# EAGLE design Mezzanine (EAGLE 9.6.1)
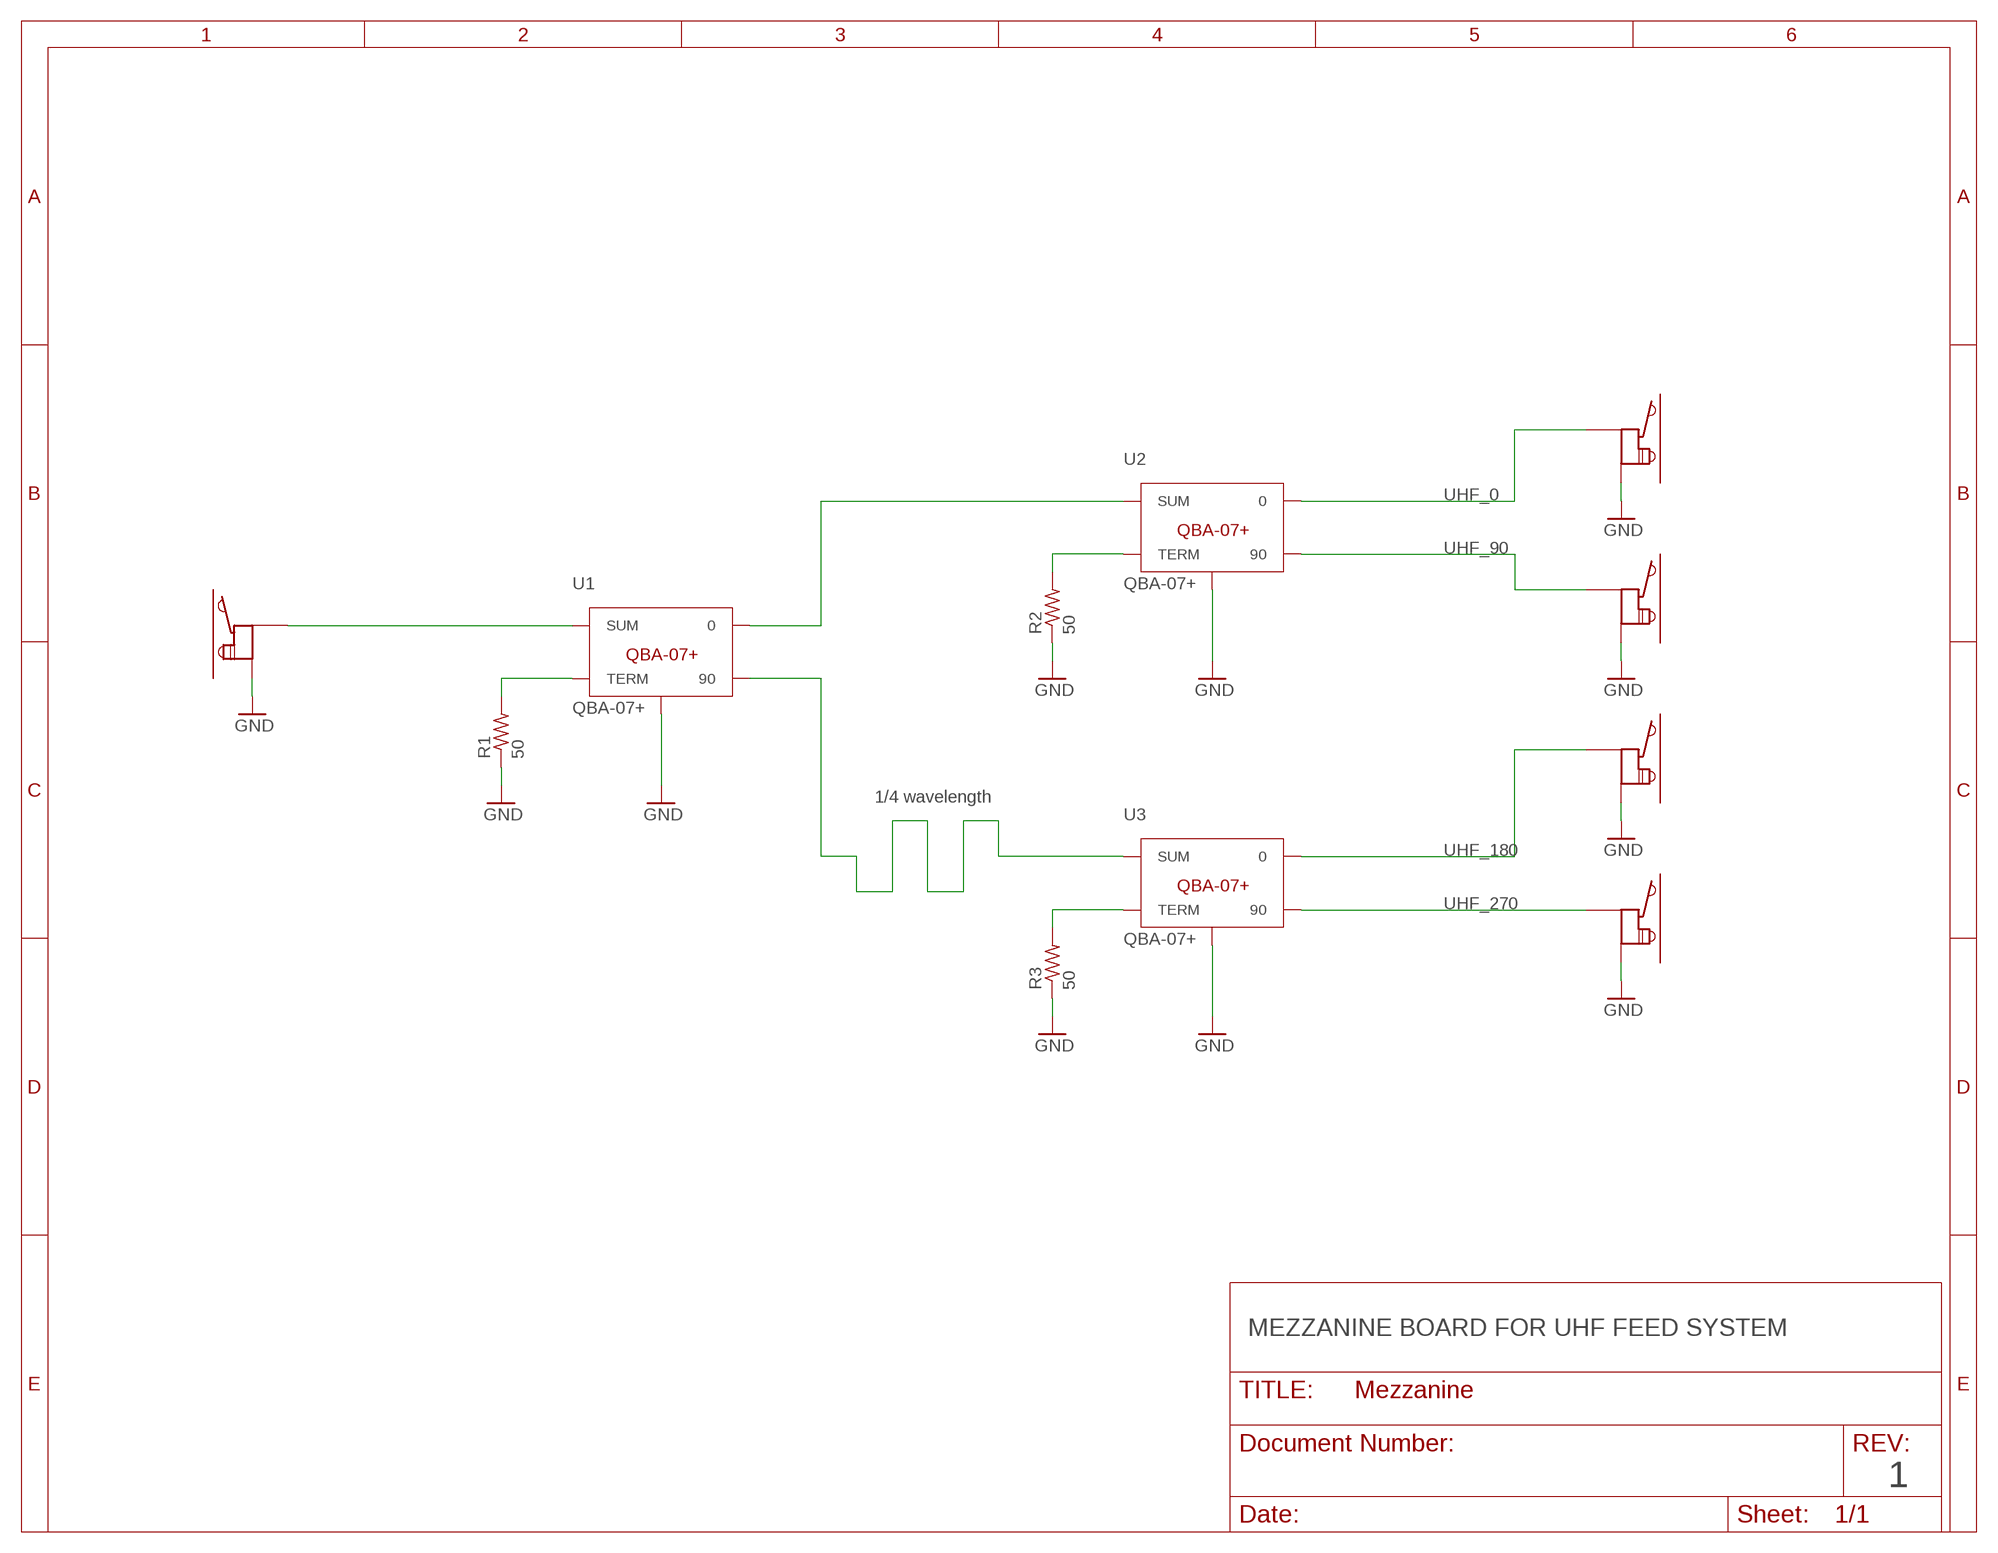
[diagram p0: schematic, sheet 1]

## Parts
R1  50  R-US_0805-B-NOSILK  [.0805-B-NOSILK]
R2  50  R-US_0805-B-NOSILK  [.0805-B-NOSILK]
R3  50  R-US_0805-B-NOSILK  [.0805-B-NOSILK]
U1  QBA-07+  [QBA-07+]
U2  QBA-07+  [QBA-07+]
U3  QBA-07+  [QBA-07+]
U$1  R107064070  [R107064070]
U$2  R107064070  [R107064070]
U$3  R107064070  [R107064070]
U$4  R107064070  [R107064070]
U$5  R107064070  [R107064070]

## Nets
GND: R1.1 R2.1 R3.1 U1.2(GND) U1.3(GND) U1.4(GND) U1.7(GND) U1.8(GND) U1.9(GND) U1.GND-NO-PAD(GND) U2.2(GND) U2.3(GND) U2.4(GND) U2.7(GND) U2.8(GND) U2.9(GND) U2.GND-NO-PAD(GND) U3.2(GND) U3.3(GND) U3.4(GND) U3.7(GND) U3.8(GND) U3.9(GND) U3.GND-NO-PAD(GND) U$1.P$2 U$1.P$3 U$2.P$2 U$2.P$3 U$3.P$2 U$3.P$3 U$4.P$2 U$4.P$3 U$5.P$2 U$5.P$3
N$1 [RF]: U1.1(SUM) U$1.P$1
N$2 [RF]: U1.6 U2.1(SUM)
N$3 [RF]: R1.2 U1.5(TERM)
N$4 [RF]: R2.2 U2.5(TERM)
N$5 [RF]: U1.10 U3.1(SUM)
N$6 [RF]: R3.2 U3.5(TERM)
UHF_0 [RF]: U2.6 U$2.P$1
UHF_90 [RF]: U2.10 U$3.P$1
UHF_180 [RF]: U3.6 U$4.P$1
UHF_270 [RF]: U3.10 U$5.P$1

## Notes on the sheet
- 1/4 wavelength
- MEZZANINE BOARD FOR UHF FEED SYSTEM
- 1

## Library data of the parts
R1-R3 = oresat-rcl:R-US_: RESISTOR, American symbol
U1-U3 = U-MiniCirc-QBA-07+_Phase-shifter:QBA-07+
U$1-U$5 = J-Radiall-R107064070-RF:R107064070

## Net classes
1 RF: width 0.38 mm, drill 0.38 mm, clearance 1 mm

## Board
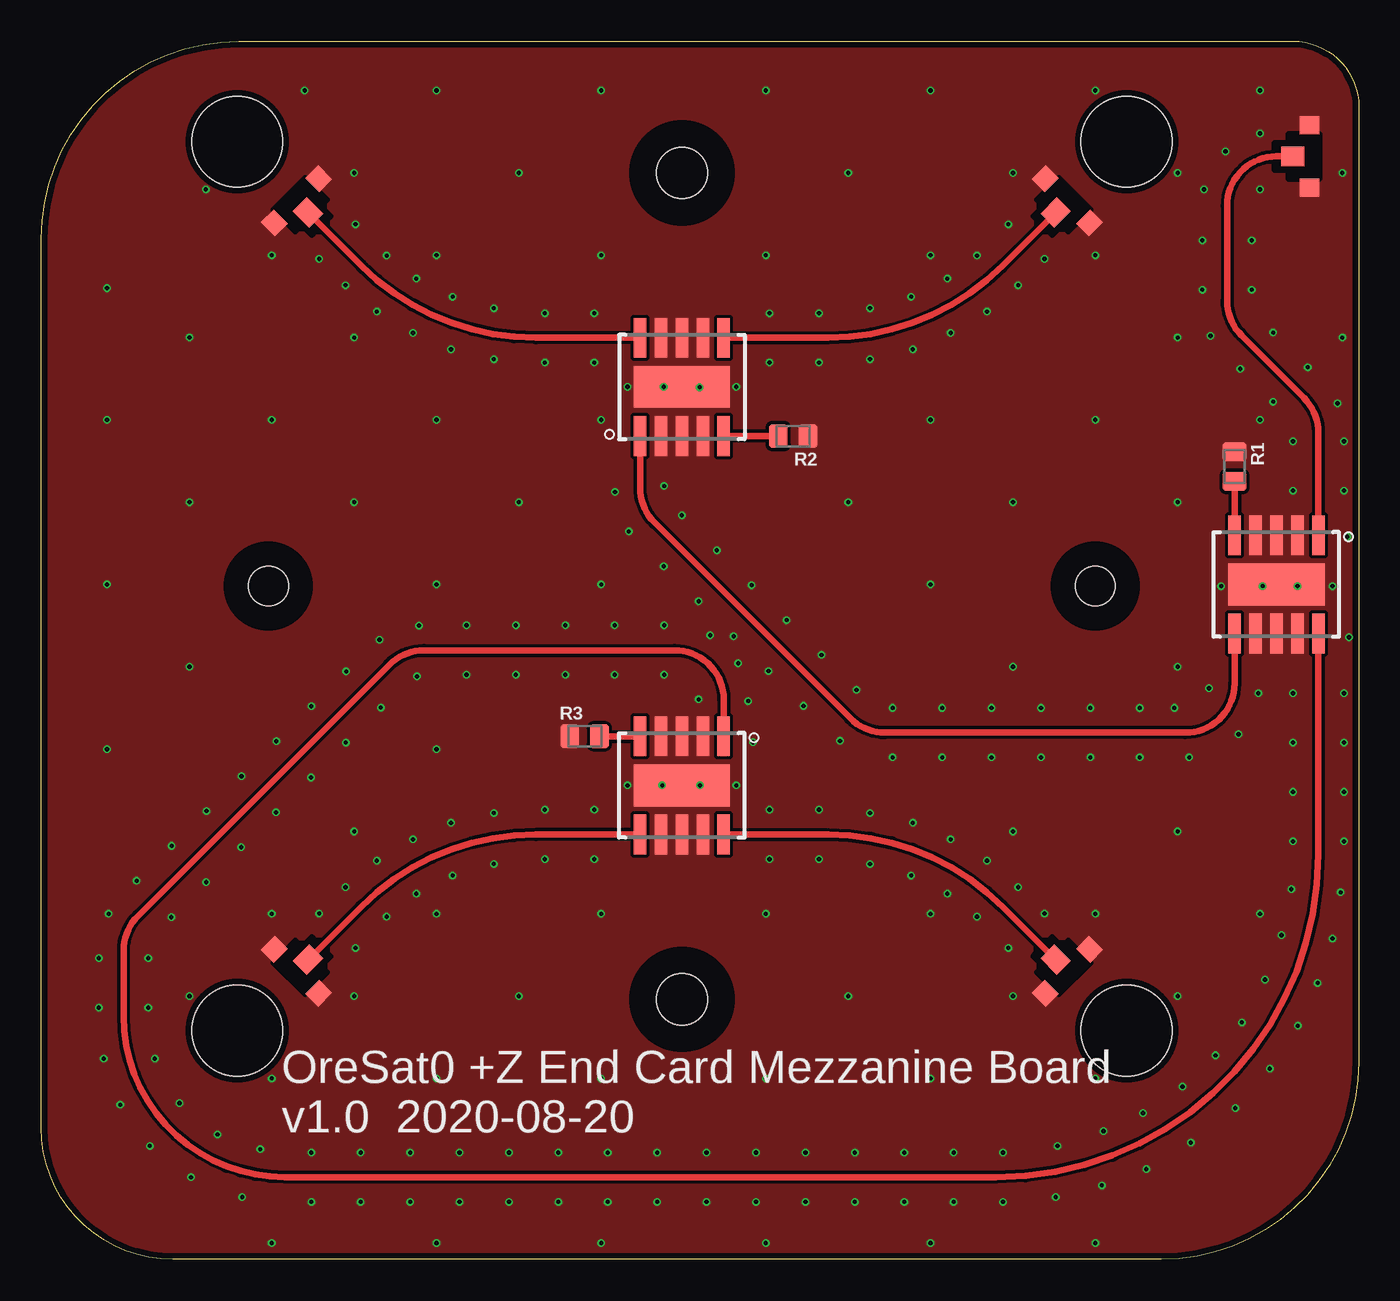
[diagram p1: board, top side]
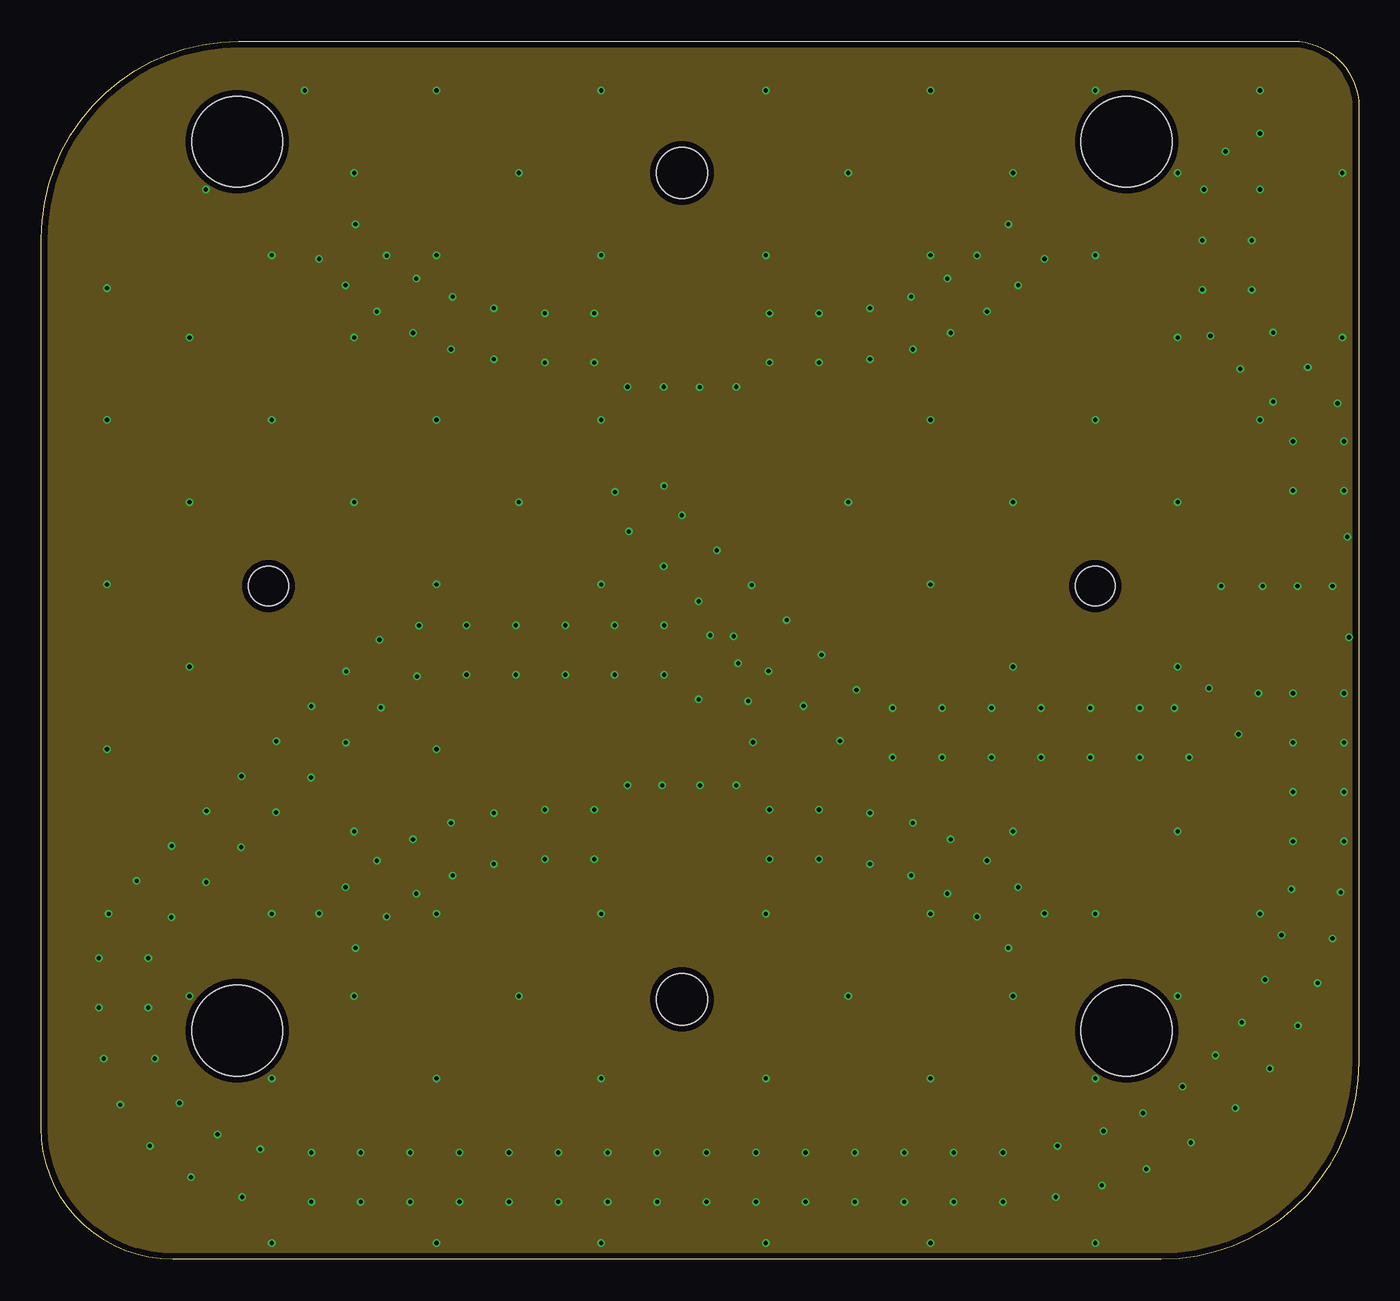
[diagram p2: board, inner layer Route2]
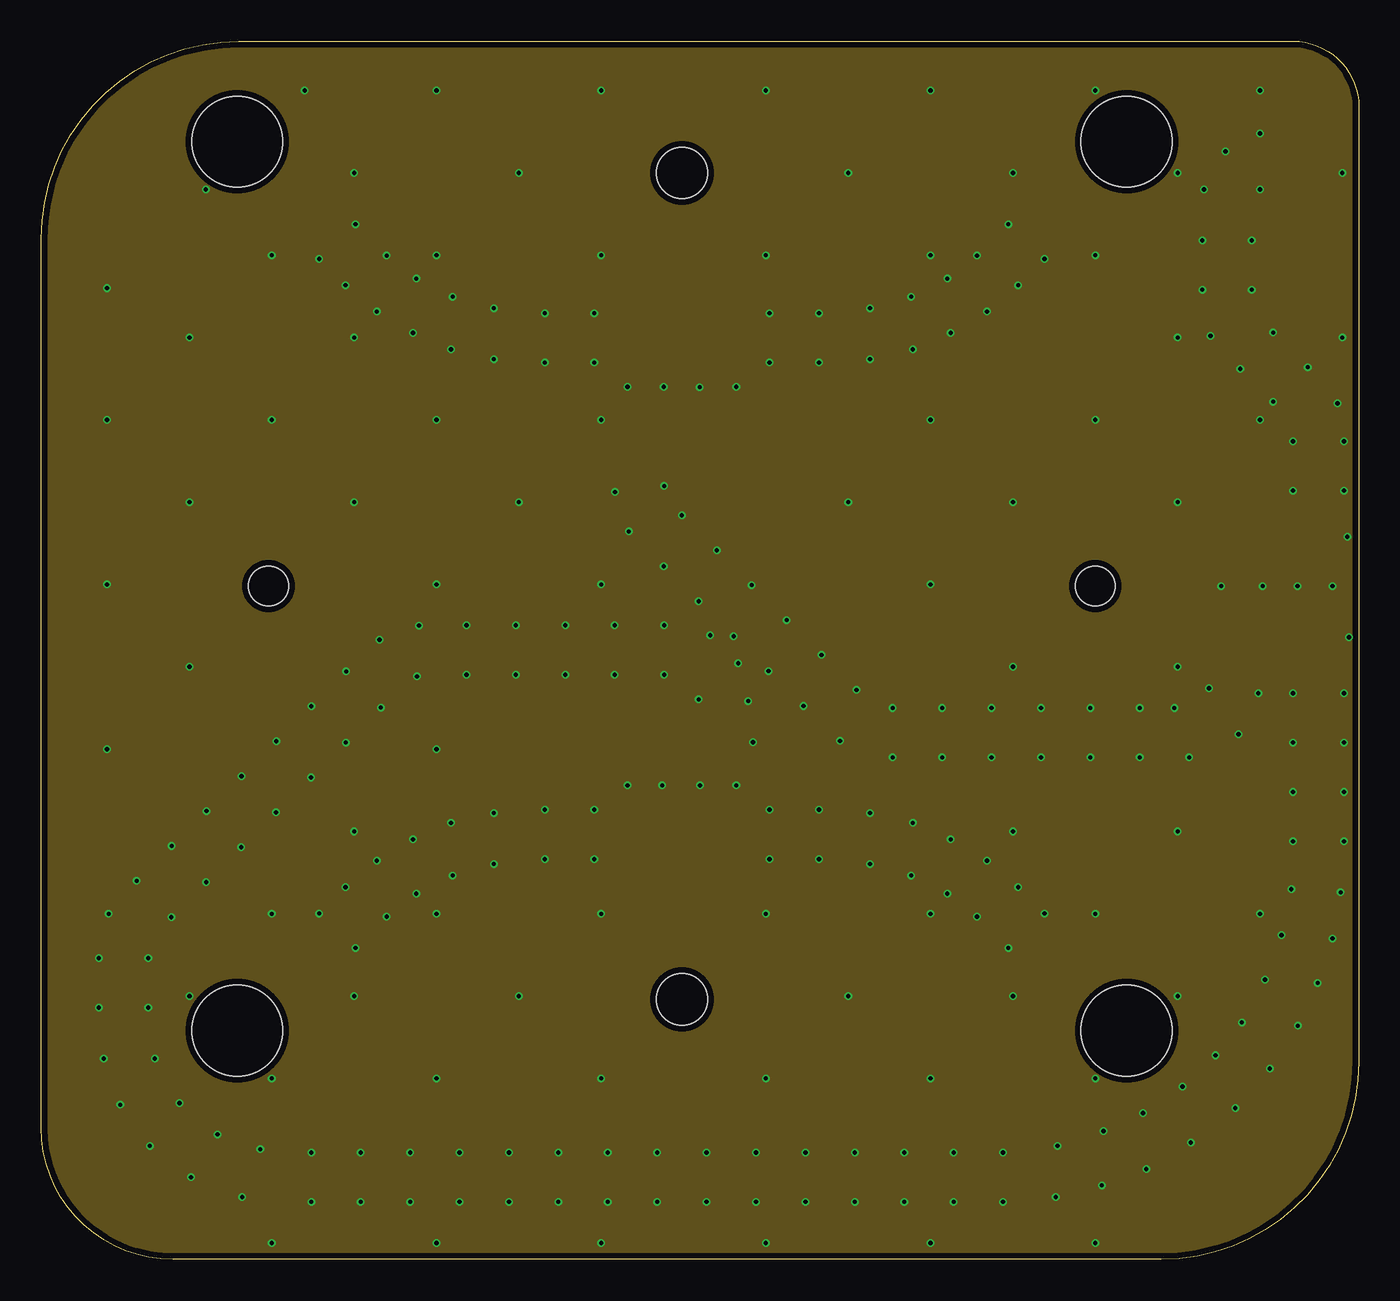
[diagram p3: board, inner layer Route15]
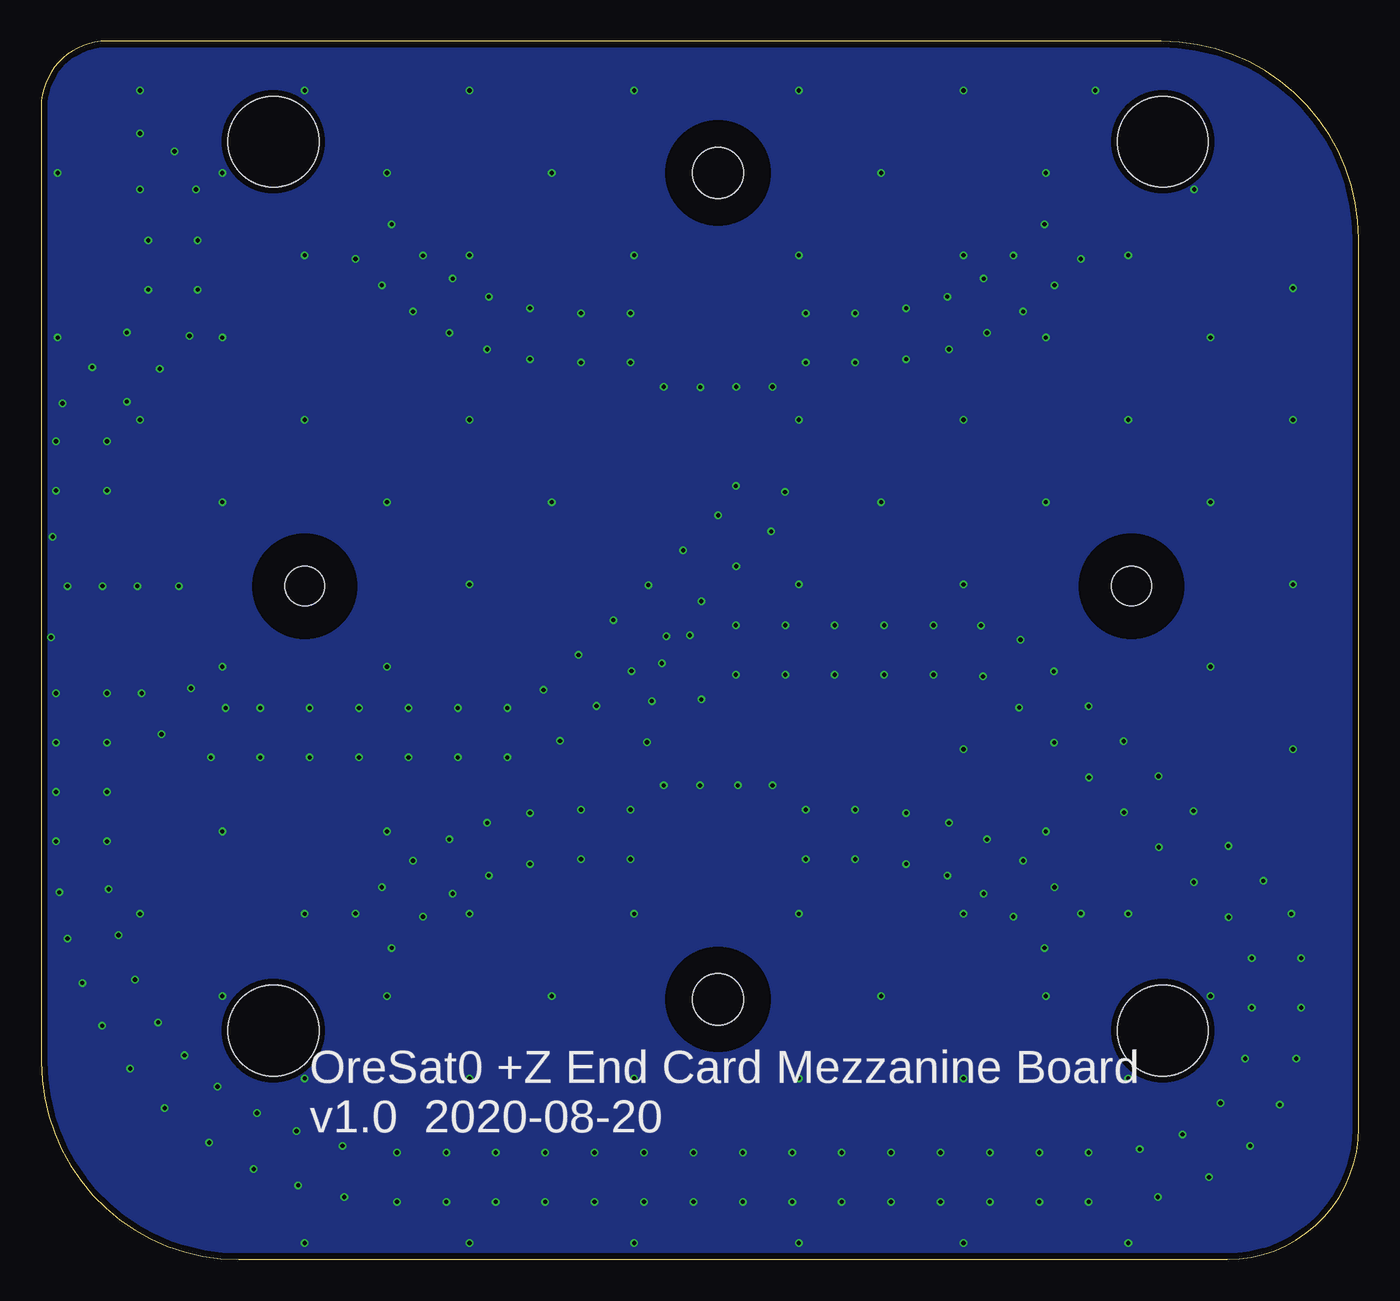
[diagram p4: board, bottom side, seen from below]

Size 80 x 74 mm. Coordinates in mm from the lower left corner, seen from the top.
Outline: 12,74 76,74 arc-90 80,70 80,12 arc-90 68,0 8,0 arc-90 0,8 0,62 arc-90 12,74
Copper layers (1*2*15*16): Top 0.035559375mm / dielectric 0.17018125mm / Route2 0.01778125mm / dielectric 47mil / Route15 0.01778125mm / dielectric 0.17018125mm / Bottom 0.035559375mm
Design rules "oshpark-4layer *": minimum track width 5mil, minimum drill 10mil, track to track 5mil, track to pad 5mil, pad to pad 5mil, via to via 5mil, smd to smd 5mil, copper to edge 15mil, drill to drill 6mil, minimum pad ring 4mil, minimum via ring 4mil, stop-mask expansion 2.5mil, vias tented up to drill 0.26mm, thermal gap 10mil
Holes 2.4 mm at 13.8,40.9 64,40.9
Holes 3.1 mm at 38.9,66 38.9,15.8
Holes 5.5 mm at 65.9,67.9 11.9,67.9 65.9,13.9 11.9,13.9
tRestrict: area 35.9,12.8 to 41.9,18.8; area 35.9,63 to 41.9,69; area 11.3,38.4 to 16.3,43.4; area 61.5,38.4 to 66.5,43.4
bRestrict: area 35.9,12.8 to 41.9,18.8; area 35.9,63 to 41.9,69; area 10.8,37.9 to 16.8,43.9; area 61,37.9 to 67,43.9

### Footprints (pad centres in the part's own frame; a part is rotated, then mirrored left to right if it is on the bottom)
.0805-B-NOSILK = smd 1.15 x 1.45: 1 -0.9,0; 2 0.9,0
QBA-07+ = smd 0.762 x 2.413: 1 -2.54,-2.985; 2 -1.27,-2.985; 3 0,-2.985; 4 1.27,-2.985; 5 2.54,-2.985; 6 2.54,2.985; 7 1.27,2.985; 8 0,2.985; 9 -1.27,2.985; 10 -2.54,2.985 | smd 5.84 x 2.54: GND-NO-PAD 0,0
R107064070 = smd 1.2 x 1.4: P$1 0,-1 | smd 1.1 x 1.2: P$2 -1.9,0; P$3 1.9,0

### Placement (x,y rotation side)
R1  72.45,48.16 270 top
R2  45.65,50.01 180 top
R3  32.99,31.78 0 top
U1  75,41 180 top
U2  38.9,53 0 top
U3  38.9,28.8 180 top
U$1  77,67 270 top
U$2  62.3,64.3 315 top
U$3  15.5,64.3 45 top
U$4  15.5,17.5 135 top
U$5  62.3,17.5 225 top

### Tracks (layer width: path | path; a pad name or v marks a point on that pad's centre or on a via)
GND  (via drill 0.25)
  other vias: 74,65 73.5,61.9 73.5,58.9 70.5,61.9 70.5,58.9 71.9,67.3 70.6,65 74,68.4 74.8,56.3 71,56.1 72.8,54.1 74.8,52.1 76.9,54.2 78.7,52 76,49.7 79.1,49.7 79.1,46.7 76,46.7 79.3,43.9 78.4,40.9 79.4,37.8 79.1,34.4 76,34.4 79.1,31.4 76,31.4 76,28.4 76,25.4 79.1,28.4 79.1,25.4 78.9,22.3 78.4,19.5 77.5,16.8 76.3,14.2 74.6,11.6 72.5,9.2 69.8,7.1 67.1,5.5 64.4,4.5 61.6,3.8 58.4,3.5 55.4,3.5 55.4,6.5 58.4,6.5 61.7,6.9 64.5,7.8 66.9,8.9 69.3,10.5 71.3,12.4 72.9,14.4 74.3,17 75.3,19.7 75.9,22.5 52.4,3.5 49.4,3.5 46.4,3.5 43.4,3.5 40.4,3.5 37.4,3.5 34.4,3.5 34.4,6.5 37.4,6.5 40.4,6.5 43.4,6.5 46.4,6.5 49.4,6.5 52.4,6.5 31.4,3.5 31.4,6.5 28.4,6.5 25.4,6.5 22.4,6.5 28.4,3.5 25.4,3.5 22.4,3.5 19.4,3.5 16.4,3.5 16.4,6.5 19.4,6.5 13.3,6.7 10.7,7.6 8.4,9.5 6.9,12.2 6.5,15.3 6.5,18.3 3.5,18.3 3.5,15.3 3.8,12.2 4.8,9.4 6.6,6.9 9.1,5 12.2,3.8 7.9,20.8 4.1,21 5.8,23 10.02,22.92 7.92,25.12 12.14,25.04 10.04,27.24 12.16,29.36 14.28,31.48 16.4,33.6 18.52,35.72 20.54,37.64 22.94,38.5 14.26,27.16 16.38,29.28 18.5,31.4 20.62,33.52 22.82,35.42 25.82,35.52 25.82,38.52 28.82,38.52 28.82,35.52 31.82,38.52 34.82,38.52 37.82,38.52 31.82,35.52 34.82,35.52 37.82,35.52 39.92,34.02 40.62,37.92 42.32,36.22 42.92,33.92 42.2,28.8 43.22,31.42 44.22,27.32 44.22,24.32 47.22,24.32 47.22,27.32 50.32,24.02 50.32,27.12 52.82,23.32 52.92,26.52 55.22,25.52 57.42,24.22 55.02,22.22 56.82,20.82 58.72,18.92 59.32,22.62 60.92,21.02 73.9,34.4 70.9,34.7 68.8,33.5 72.7,31.9 69.7,30.5 66.7,30.5 66.7,33.5 63.7,30.5 63.7,33.5 60.7,33.5 57.7,33.5 54.7,33.5 51.7,33.5 60.7,30.5 57.7,30.5 54.7,30.5 51.7,30.5 48.5,31.5 49.5,34.6 46.28,33.62 44.16,35.74 42.04,37.86 39.92,39.98 37.8,42.1 35.68,44.22 47.38,36.72 45.26,38.84 43.14,40.96 41.02,43.08 38.9,45.2 37.82,46.98 34.84,46.62 35.6,28.8 37.7,28.8 40,28.8 76.28,40.9 74.16,40.9 71.64,40.9 33.58,54.48 33.58,57.48 30.58,57.48 30.58,54.48 27.48,57.78 27.48,54.68 24.98,58.48 24.88,55.28 22.58,56.28 20.38,57.58 22.78,59.58 20.98,60.98 19.08,62.88 18.48,59.18 16.88,60.78 4,59 10,65 16,71 24,71 34,71 44,71 54,71 64,71 74,71 79,66 79,56 69,46 64,51 64,61 69,66 69,56 74,51 59,36 69,36 59,46 54,41 49,46 54,51 44,61 49,66 54,61 34,61 29,66 24,61 19,66 14,61 9,56 4,51 4,41 9,46 14,51 19,56 24,51 19,46 9,36 4,31 24,41 29,46 34,41 34,51 24,31 19,26 14,21 9,16 14,11 19,16 24,21 29,16 24,11 34,11 34,21 44,21 49,16 44,11 54,21 54,11 64,11 69,16 74,21 64,1 54,1 44,1 34,1 24,1 14,1 69,26 59,26 44.22,54.48 44.22,57.48 47.22,57.48 47.22,54.48 50.32,57.78 50.32,54.68 52.82,58.48 52.92,55.28 55.22,56.28 57.42,57.58 55.02,59.58 56.82,60.98 58.72,62.88 59.32,59.18 60.92,60.78 42.2,53 39.98,52.98 37.8,53 35.6,53 33.58,27.32 33.58,24.32 30.58,24.32 30.58,27.32 27.48,24.02 27.48,27.12 24.98,23.32 24.88,26.52 22.58,25.52 20.38,24.22 22.78,22.22 20.98,20.82 19.08,18.92 18.48,22.62 16.88,21.02 59,16 64,21 59,66
  pour Top (isolate 0.2, rank 6, no thermals): 0,74 0,0 80,0 80,74
  pour Route2 (isolate 0.2, rank 6, no thermals): 0,74 0,0 83,0 83,74
  pour Route15 (isolate 0.2, rank 6, no thermals): 0,74 0,0 83,0 83,74
  pour Bottom (isolate 0.2, rank 6, no thermals): 0,74 0,0 80,0 80,74
N$1
  Top 0.38: U$1.P$1 75,67 arc90 72,64 72,58.24 arc45 72.88,56.12 76.66,52.34 arc-45 77.54,50.22 U1.1
N$2
  Top 0.38: U1.6 72.46,35 arc-90 69.46,32 51.24,32 arc-45 49.12,32.88 37.24,44.76 arc-45 36.36,46.88 U2.1
N$3
  Top 0.38: R1.2 arc-45 72.46,47.24 U1.5
N$4
  Top 0.38: R2.2 41.45,50.01 arc-45 U2.5
N$5
  Top 0.38: U1.10 77.54,24.58 arc-90 57.96,5 14.79,5 arc-90 5,14.79 5,18.76 arc-45 5.88,20.88 21.12,36.12 arc-45 23.24,37 38.44,37 arc-90 41.44,34 U3.1
N$6
  Top 0.38: R3.2 36.35,31.78 arc45 U3.5
UHF_0
  Top 0.38: U2.6 47.77,55.98 arc45 58.38,60.38 U$2.P$1
UHF_90
  Top 0.38: U2.10 30.03,55.98 arc-45 19.42,60.38 U$3.P$1
UHF_180
  Top 0.38: U3.6 30.03,25.81 arc45 19.42,21.42 U$4.P$1
UHF_270
  Top 0.38: U3.10 47.77,25.81 arc-45 58.38,21.42 U$5.P$1

### Text on the board
bPlace: OreSat0 +Z End Card Mezzanine Board / v1.0 2020-08-20
tNames: OreSat0 +Z End Card Mezzanine Board / v1.0 2020-08-20